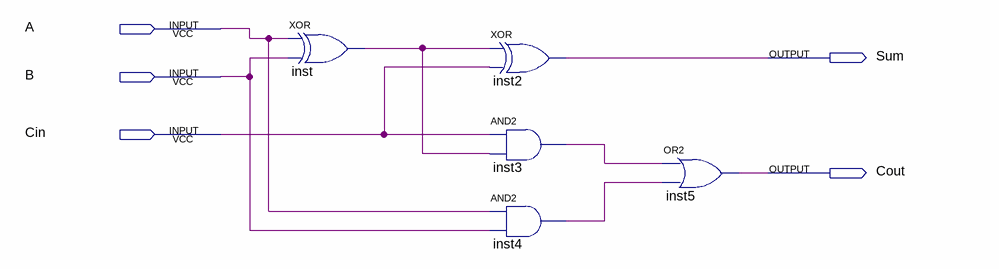
[diagram p0: schematic sheet]
// Quartus schematic Full_Adder.bdf as structural Verilog: 5 symbols, 5 pins
module Full_Adder (
  input  A,
  input  B,
  input  Cin,
  output Sum,
  output Cout
);

  wire inst3_out, inst4_out, inst_out;

  xor inst (inst_out, A, B);
  xor inst2 (Sum, inst_out, Cin);
  and inst3 (inst3_out, Cin, inst_out);
  and inst4 (inst4_out, A, B);
  or inst5 (Cout, inst3_out, inst4_out);
endmodule
